# EAGLE design breadboard_rev05 (EAGLE 6.1)
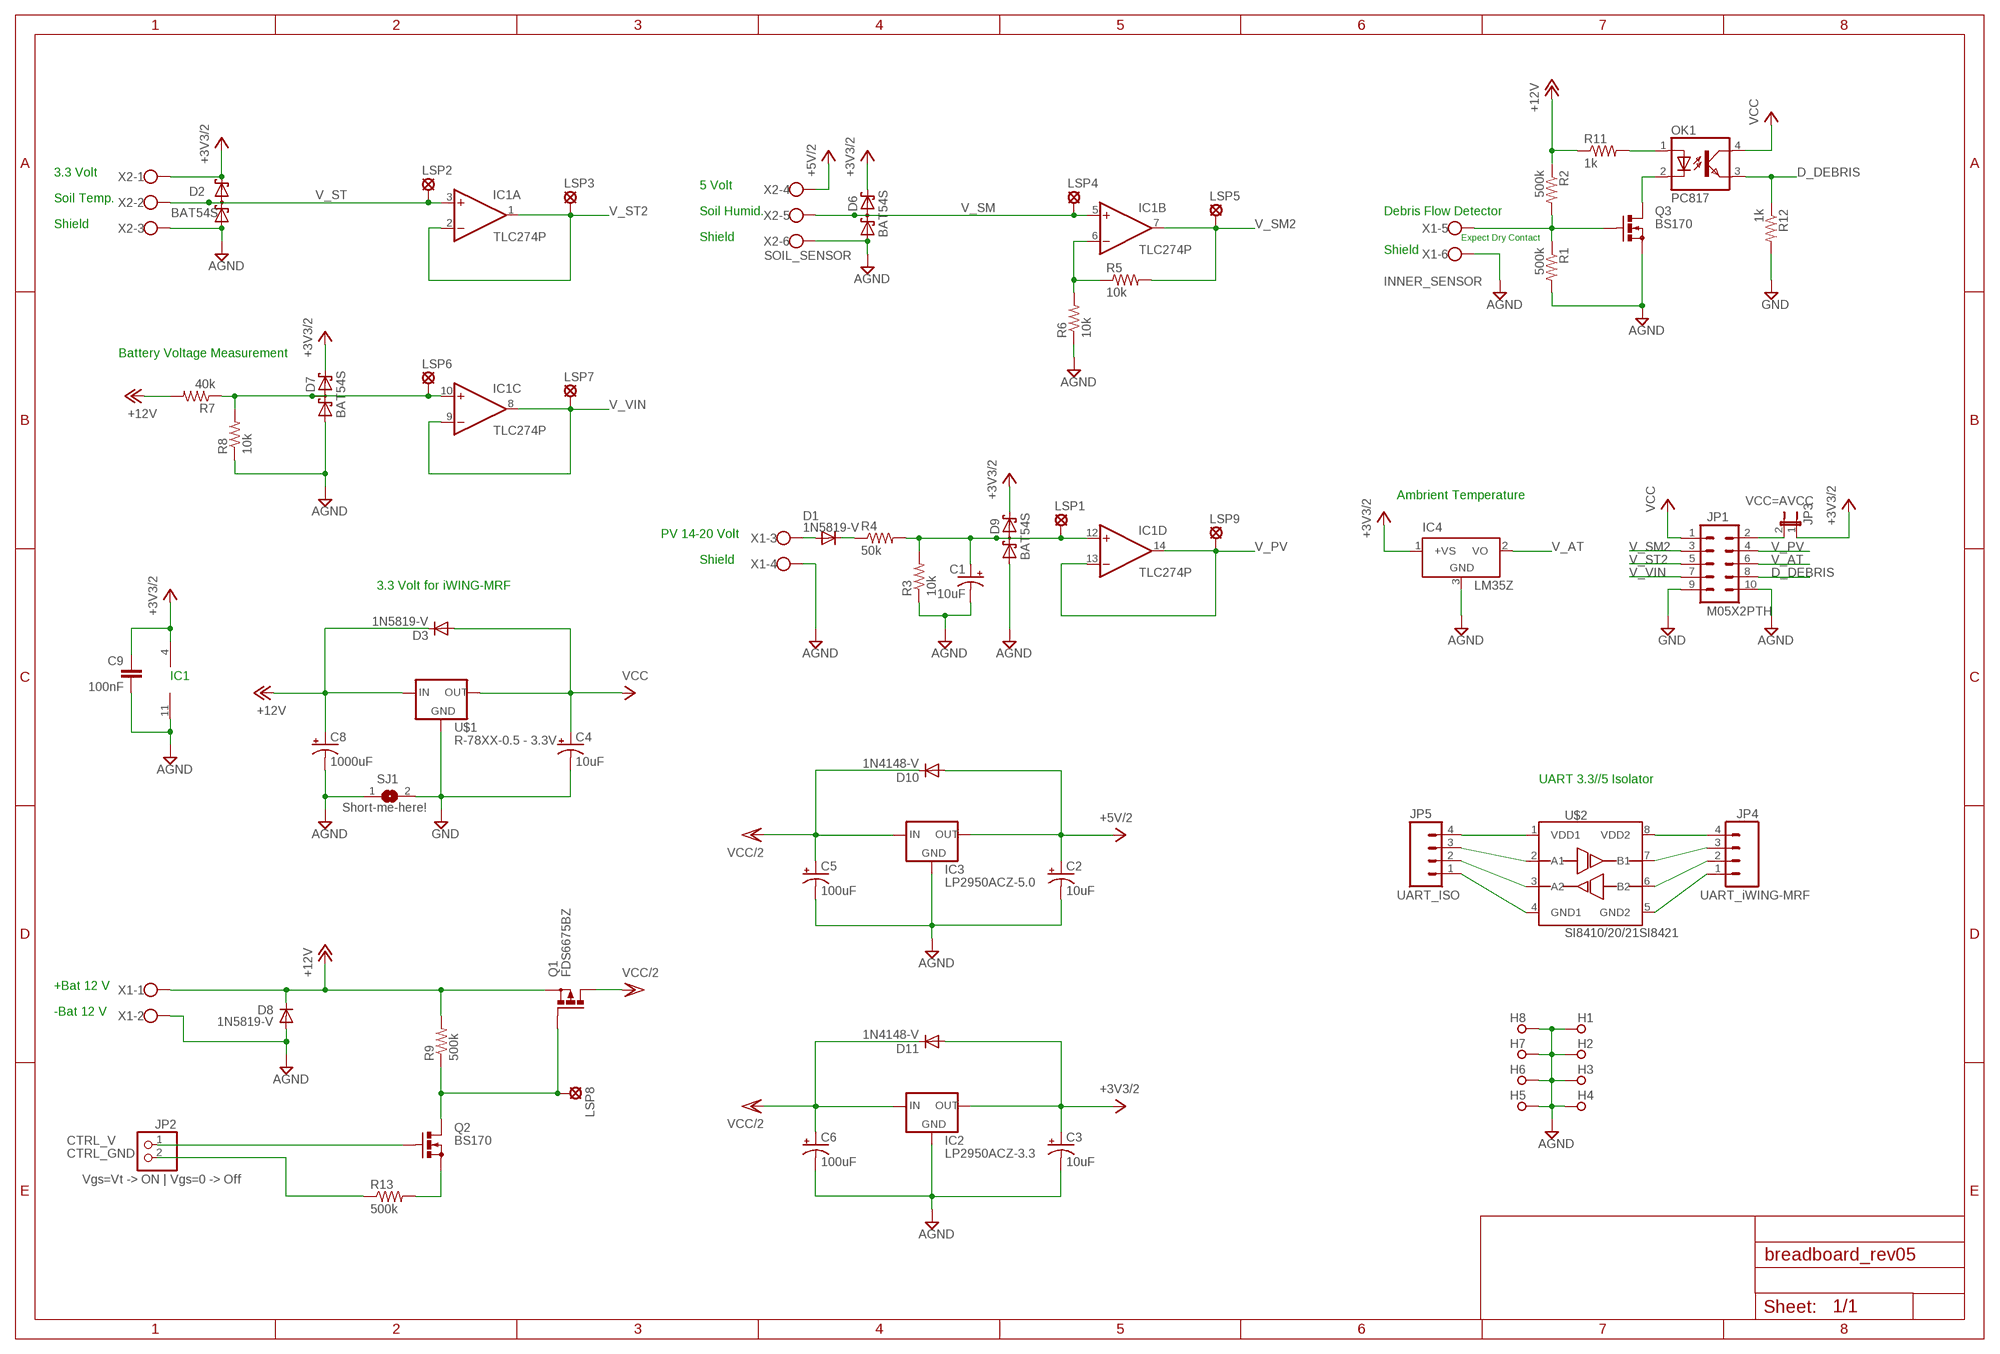
[diagram p0: schematic, sheet 1]

## Parts
C1  10uF  RCL_CPOL-USE2.5-7  [RCL_E2,5-7]
C2  10uF  RCL_CPOL-USE2.5-7  [RCL_E2,5-7]
C3  10uF  RCL_CPOL-USE2.5-7  [RCL_E2,5-7]
C4  10uF  RCL_CPOL-USE2.5-7  [RCL_E2,5-7]
C5  100uF  RCL_CPOL-USE2.5-7  [RCL_E2,5-7]
C6  100uF  RCL_CPOL-USE2.5-7  [RCL_E2,5-7]
C8  1000uF  RCL_CPOL-USE5-13  [RCL_E5-13]
C9  100nF  RCL_C-EU050-025X075  [RCL_C050-025X075]
D1  1N5819-V  [DO41-150V]
D2  BAT54S  [SOT23]
D3  1N5819-V  [DO41-150V]
D6  BAT54S  [SOT23]
D7  BAT54S  [SOT23]
D8  1N5819-V  [DO41-150V]
D9  BAT54S  [SOT23]
D10  1N4148-V  [DO35-100V]
D11  1N4148-V  [DO35-100V]
H1  SPECIAL_DRILL_0.1560  [PAD_0.1560]
H2  SPECIAL_DRILL_0.1560  [PAD_0.1560]
H3  SPECIAL_DRILL_0.1560  [PAD_0.1560]
H4  SPECIAL_DRILL_0.1560  [PAD_0.1560]
H5  SPECIAL_DRILL_0.1560  [PAD_0.1560]
H6  SPECIAL_DRILL_0.1560  [PAD_0.1560]
H7  SPECIAL_DRILL_0.1560  [PAD_0.1560]
H8  SPECIAL_DRILL_0.1560  [PAD_0.1560]
IC1  TLC274P  [DIL14]
IC2  LP2950ACZ-3.3  [TO92]
IC3  LP2950ACZ-5.0  [TO92]
IC4  LM35Z  [TO92]
JP1  M05X2PTH  [AVR_ICSP]
JP2  Vgs=Vt -> ON | Vgs=0 -> Off  PINHD-1X2  [1X02]
JP3  VCC=AVCC  JP1E  [JUMPER_JP1]
JP4  UART_iWING-MRF  M04POLAR  [MOLEX-1X4]
JP5  UART_ISO  M04POLAR  [MOLEX-1X4]
LSP1  LSP13  [LSP13]
LSP2  LSP13  [LSP13]
LSP3  LSP13  [LSP13]
LSP4  LSP13  [LSP13]
LSP5  LSP13  [LSP13]
LSP6  LSP13  [LSP13]
LSP7  LSP13  [LSP13]
LSP8  LSP13  [LSP13]
LSP9  LSP13  [LSP13]
OK1  PC817  [DIL04]
Q1  FDS6675BZ  P-MOSFET-SO8  [SO-08]
Q2  BS170  [SOT54E]
Q3  BS170  [SOT54E]
R1  500k  RCL_R-US_0204/7  [RCL_0204/7]
R2  500k  RCL_R-US_0204/7  [RCL_0204/7]
R3  10k  RCL_R-US_0204/7  [RCL_0204/7]
R4  50k  RCL_R-US_0204/7  [RCL_0204/7]
R5  10k  RCL_R-US_0204/7  [RCL_0204/7]
R6  10k  RCL_R-US_0204/7  [RCL_0204/7]
R7  40k  RCL_R-US_0204/7  [RCL_0204/7]
R8  10k  RCL_R-US_0204/7  [RCL_0204/7]
R9  500k  RCL_R-US_0204/7  [RCL_0204/7]
R11  1k  RCL_R-US_0204/7  [RCL_0204/7]
R12  1k  RCL_R-US_0204/7  [RCL_0204/7]
R13  500k  RCL_R-US_0204/7  [RCL_0204/7]
SJ1  Short-me-here!  SJ  [SJ]
U$1  R-78XX-0.5 - 3.3V  R-78XX-0.5  [SIP3]
U$2  SI8410/20/21SI8421  [SO-08]
X1  INNER_SENSOR  5EHDRC-6P  [5EHDRC-6P]
X2  SOIL_SENSOR  5EHDRC-6P  [5EHDRC-6P]

## Nets
+3V3/2: C3.+ C9.1 D2.2(C2) D6.2(C2) D7.2(C2) D9.2(C2) D11.A IC1.4(P:V+) IC2.1(OUT) IC4.1(+VS) JP3.1 X2.1
+5V/2: C2.+ D10.A IC3.1(OUT) X2.4
+12V: C8.+ D3.C D8.C Q1.1(S) Q1.2(S) Q1.3(S) R2.1 R7.2 R9.2 R11.1 U$1.1(IN) X1.1
AGND: C1.- C2.- C3.- C5.- C6.- C8.- C9.2 D2.1(A1) D6.1(A1) D7.1(A1) D8.A D9.1(A1) H1.1 H2.1 H3.1 H4.1 H5.1 H6.1 H7.1 H8.1 IC1.11(P:V-) IC2.2(GND) IC3.2(GND) IC4.3(GND) JP1.10 Q3.S R1.2 R3.1 R6.1 R8.1 SJ1.1 X1.2 X1.4 X1.6 X2.3 X2.6
CTRL_GND: JP2.2 R13.1
CTRL_V: JP2.1 Q2.G
D_DEBRIS: JP1.8 OK1.3(EMIT) R12.1
GND: C4.- JP1.9 R12.2 SJ1.2 U$1.2(GND)
N$2: D7.3(C1A2) IC1.10(C:+IN) LSP6.MP R7.1 R8.2
N$3: IC1.6(B:-IN) R5.1 R6.2
N$10: LSP8.MP Q1.4(G) Q2.D R9.1
N$13: JP1.2 JP3.2
N$14: OK1.1(A) R11.2
N$15: Q2.S R13.2
N$16: OK1.2(C) Q3.D
N$17: Q3.G R1.1 R2.2 X1.5
N$18: D1.A X1.3
N$19: JP4.4 U$2.8(VDD2)
N$20: D1.C R4.1
N$21: JP4.1 U$2.5(GND2)
N$22: JP5.4 U$2.1(VDD1)
N$23: JP5.3 U$2.2(A1)
N$24: C1.+ D9.3(C1A2) IC1.12(D:+IN) LSP1.MP R3.2 R4.2
N$25: JP5.2 U$2.3(A2)
N$26: JP5.1 U$2.4(GND1)
RX: JP4.3 U$2.7(B1)
TX: JP4.2 U$2.6(B2)
V_AT: IC4.2(VO) JP1.6
V_PV: IC1.13(D:-IN) IC1.14(D:OUT) JP1.4 LSP9.MP
V_SM: D6.3(C1A2) IC1.5(B:+IN) LSP4.MP X2.5
V_SM2: IC1.7(B:OUT) JP1.3 LSP5.MP R5.2
V_ST: D2.3(C1A2) IC1.3(A:+IN) LSP2.MP X2.2
V_ST2: IC1.1(A:OUT) IC1.2(A:-IN) JP1.5 LSP3.MP
V_VIN: IC1.8(C:OUT) IC1.9(C:-IN) JP1.7 LSP7.MP
VCC: C4.+ D3.A JP1.1 OK1.4(COL) U$1.3(OUT)
VCC/2: C5.+ C6.+ D10.C D11.C IC2.3(IN) IC3.3(IN) Q1.5(D) Q1.6(D) Q1.7(D) Q1.8(D)

## Notes on the sheet
- 3.3 Volt
- 5 Volt
- Soil Temp.
- Soil Humid. | Debris Flow Detector
- Shield
- Shield | Expect Dry Contact
- Shield
- Battery Voltage Measurement
- Ambrient Temperature
- PV 14-20 Volt
- Shield
- 3.3 Volt for iWING-MRF
- IC1
- UART 3.3//5 Isolator
- +Bat 12 V
- -Bat 12 V

## Library data of the parts
C1-C6 C8 = SDI12IB_v0.5:RCL_CPOL-US: POLARIZED CAPACITOR, American symbol
C9 = ipas:RCL_C-EU: CAPACITOR, European symbol
D1 D3 D8 = ipas:1N5819: DIODE 1N5817 THRU 1N5819 1.0 AMP. Schottky Barrier Rectifiers Features Low forward voltage drop High current capability High reliability High surge current capability
D2 D6 D7 D9 = diode:BAT54S: Schottky Diodes Pin connection corrected 2011-05-04 Source: Fairchild .. BAT54.pdf
D10 D11 = ipas:1N4148: DIODE high speed (Philips)
H1-H8 = ipas:SPECIAL_DRILL_: Special drills
IC1 = linear:TLC274: OP AMP
IC2 IC3 = v-reg:LP2950?*: Source: http://cache.national.com/ds/LP/LP2950.pdf
IC4 = ipas:LM35: Precision Centigrade Temperature Sensors Features Calibrated directly in ̊ Celsius (Centigrade) Linear + 10.0 mV/ ̊C scale factor 0.5 ̊C accuracy guaranteeable (at +25 ̊C) Rated for full −55 ̊ to +150 ̊C range Suitable for remote applications Low cost due to wafer-level trimming Operates from 4 to 30 volts Less than 60 μA current drain Low self-heating, 0.08 ̊C in still air Nonlinearity only ± 1⁄4 ̊C typical Low impedance output, 0.1 Ω for 1 mA load The LM35 series are precision integrated-circuit temperature sensors, whose output voltage is linearly proportional to the Celsius (Centigrade) temperature. The LM35 thus has an advantage over linear temperature sensors calibrated in ̊ Kelvin, as the user is not required to subtract a large constant voltage from its output to obtain convenient Centi- grade scaling. The LM35 does not require any external calibration or trimming to provide typical accuracies of ± 1⁄4 ̊C at room temperature and ± 3⁄4 ̊C over a full −55 to +150 ̊C temperature range. Low cost is assured by trimming and calibration at the wafer level. The LM35’s low output imped- ance, linear output, and precise inherent calibration make interfacing to readout or control circuitry especially easy. It can be used with single power supplies, or with plus and minus supplies. As it draws only 60 μA from its supply, it has very low self-heating, less than 0.1 ̊C in still air. The LM35 is rated to operate over a −55 ̊ to +150 ̊C temperature range, while the LM35C is rated for a −40 ̊ to +110 ̊C range (−10 ̊ with improved accuracy). The LM35 series is available pack- aged in hermetic TO-46 transistor packages, while the LM35C, LM35CA, and LM35D are also available in the plastic TO-92 transistor package. The LM35D is also avail- able in an 8-lead surface mount small outline package and a plastic TO-220 package. Source: http://cache.national.com/ds/LM/LM50.pdf
JP1 = SparkFun-Connectors:M05X2: Header 5x2 Standard 10-pin dual row 0.1" header. Commonly used with AVR-ISP. Use with Spark Fun Electronics SKU: PRT-00778
JP2 = pinhead:PINHD-1X2: PIN HEADER
JP3 = ipas:JP1E: JUMPER
JP4 JP5 = ipas:M04: Header 4 Standard 4-pin 0.1" header. Use with straight break away headers (SKU : PRT-00116), right angle break away headers (PRT-00553), swiss pins (PRT-00743), machine pins (PRT-00117), and female headers (PRT-00115). Molex polarized connector foot print use with SKU : PRT-08231 with associated crimp pins and housings. 1MM SMD Version SKU: PRT-10208
LSP1-LSP9 = solpad:LSP13: SOLDER PAD drill 1.3 mm, distributor Buerklin, 12H562
OK1 = ipas:PC817: SHARP OPTO COUPLER; MPN: PC817X4J000F; OC_FARNELL: 9707727; OC_NEWARK: 97K7059
Q1 = transistor-power:P-MOSFET-SO8: P-Channel MOSFET Example: FDS4435A; P-Channel Logic Level PowerTrench® MOSFET FDS4465; P-Channel 1.8V Specified PowerTrench® MOSFET Source: www.fairchildsemi.com
Q2 Q3 = transistor-small-signal:BS170: N-CHANNEL MOS FET
R1-R9 R11-R13 = SDI12IB_v0.5:RCL_R-US_: RESISTOR, American symbol
SJ1 = jumper:SJ: SMD solder JUMPER
U$1 = ipas:R-78XX-0.5: The R-78xx-Series high efficiency switching regulators are ideally suited to replace 78xx linear regulators and are pin compatible. The efficiency of up to 97% means that very little energy is wasted as heat so there is no need for any heat sinks with their additional space and mounting costs. Low ripple and noise figures and short circuit , overload and over- temperature protection round off the specifications of this versatile converter series.This R-78xx-0.5 is fully certified to EN 60601-1-2 (Medical Equipment), EN 55022 (Emissions), and EN55024 (Immunity) EMC Standards and for EN-60950-1 Safety.
U$2 = ipas:SI8410/20/21: SI8410 / SI8420 / SI8421 ISOPROLOW - POWER SINGLE AND DUAL-CHANNEL DIGITAL ISOLATORS Features High-speed operation Narrow Body SOIC Wide Operating Supply Voltage: isolation 2.70–5.5 V 5 V Operation: 2.70 V Operation: The Silicon Laboratories’ family of ultra low power digital isolators are CMOS devices that employ an RF coupler to transmit digital information across an isolation barrier. Very high speed operation at low power levels is achieved. These devices are available in an 8-pin narrow-body SOIC package. Two speed grade options (1 and 150 Mbps) are available and achieve worst-case propagation delays of less than 10 ns.
X1 X2 = ipas:5EHDRC-6P: Dinkle Headers(Sockets) for pluggable terminal blocks / ECH & EHD series TERMINAL BLOCK, 300V/15A

## Net classes
1 power: width 0.406 mm, clearance 0.203 mm

## Board
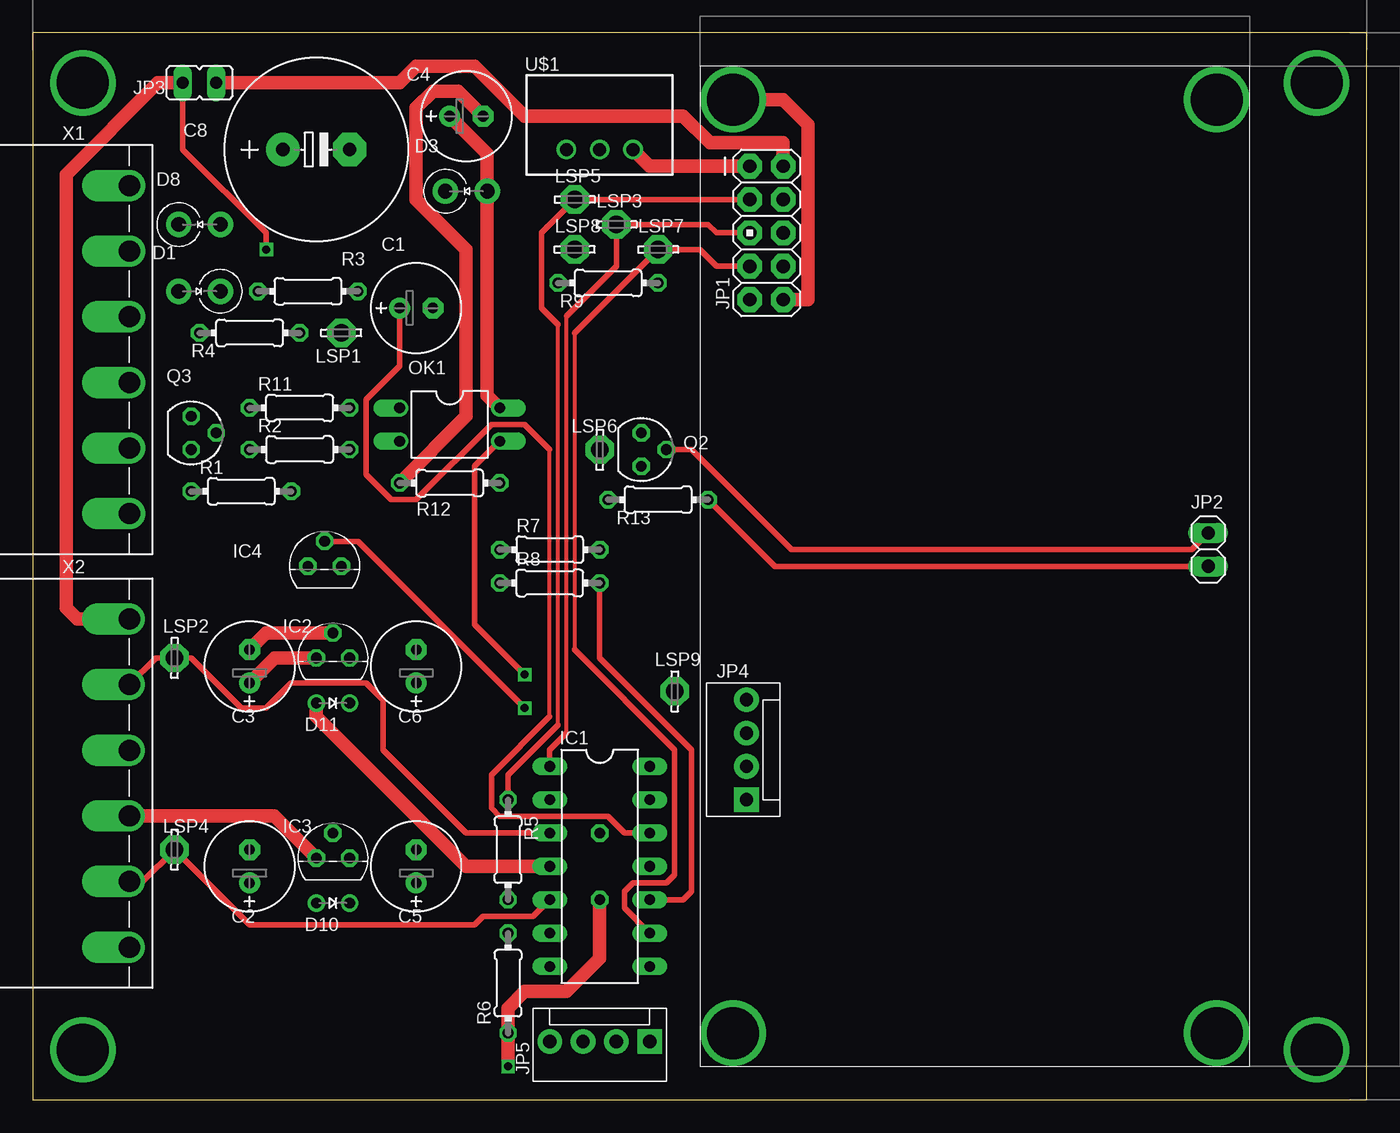
[diagram p1: board, top side]
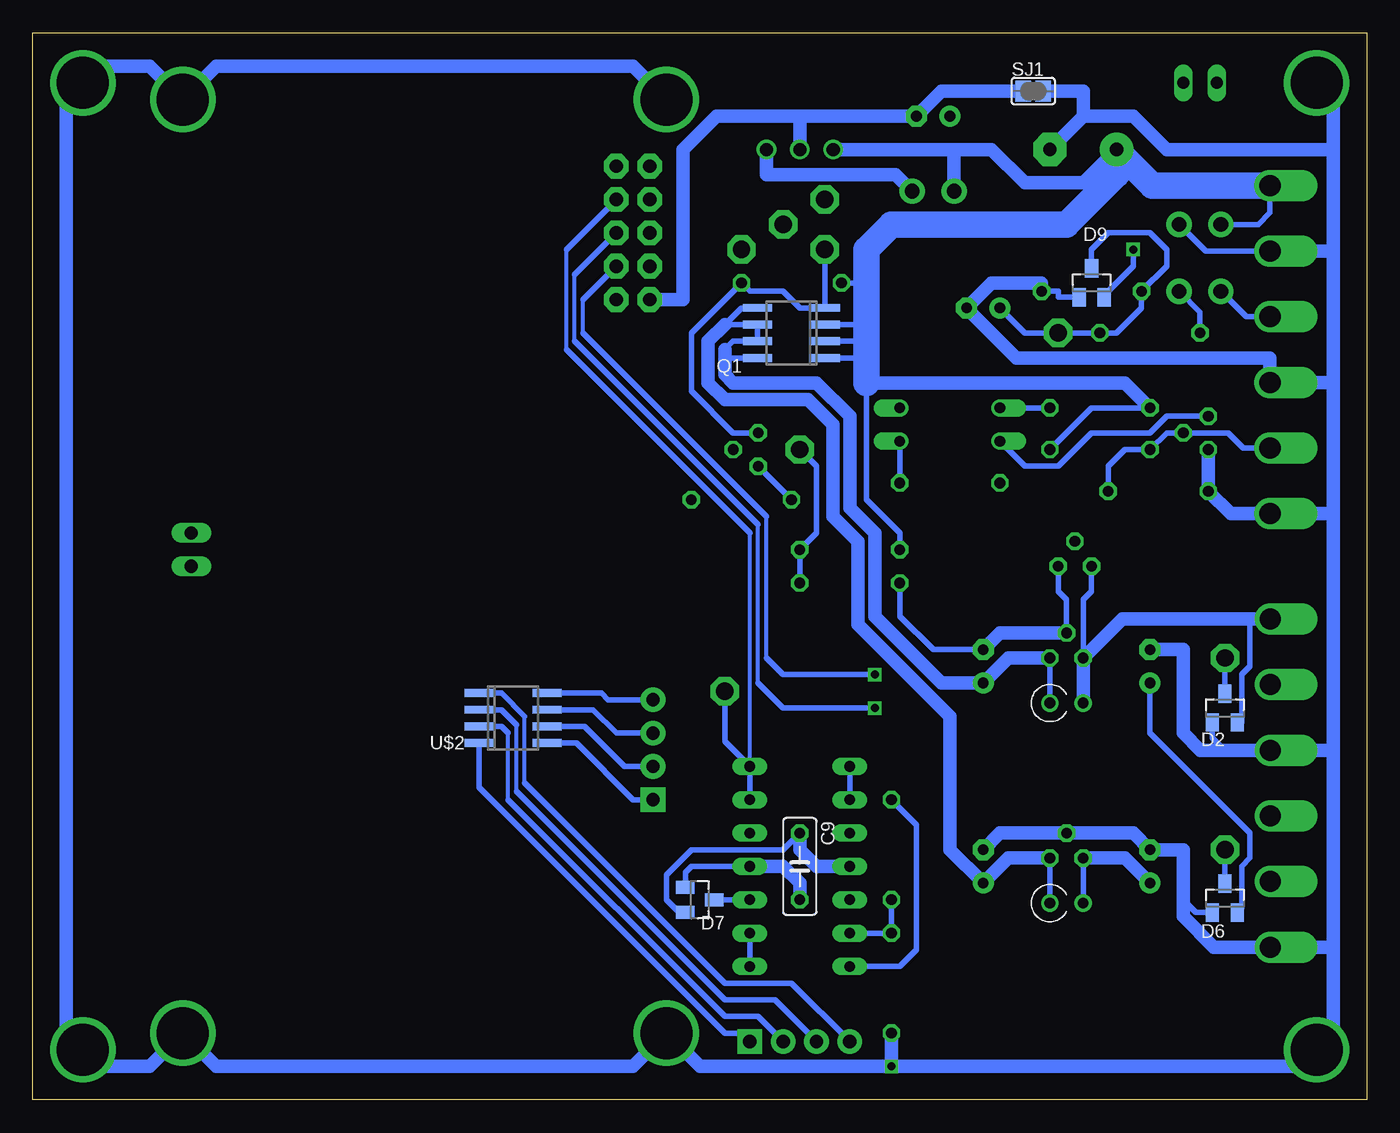
[diagram p2: board, bottom side, seen from below]

Size 101.6 x 81.28 mm. Coordinates in mm from the lower left corner, seen from the top.
Outline: 0,0 101.6,0 101.6,81.28 0,81.27 0,0
Copper layers (1*16): Top 0.035mm / dielectric 1.5mm / Bottom 0.035mm
Design rules: minimum track width 10mil, minimum drill 24mil, track to track 10mil, track to pad 10mil, pad to pad 10mil, via to via 10mil, smd to smd 10mil, copper to edge 40mil, drill to drill 10mil, minimum pad ring 10mil, minimum via ring 8mil, stop-mask expansion 4mil, vias tented up to drill 0mil, thermal gap 10mil

### Footprints (pad centres in the part's own frame; a part is rotated, then mirrored left to right if it is on the bottom)
RCL_E2,5-7 = drill 0.813 pad 1.6: + -1.27,0 | drill 0.813 pad 1.6 octagon: - 1.27,0
RCL_E5-13 = drill 1.016 pad 2.54: + -2.54,0 | drill 1.016 pad 2.54 octagon: - 2.54,0
RCL_C050-025X075 = drill 0.813 octagon: 1 -2.54,0; 2 2.54,0
DO41-150V = drill 1.118 pad 1.93: A 1.587,0; C -1.587,0
SOT23 = smd 1 x 1.4: 1 -0.95,-1.1; 2 0.95,-1.1; 3 0,1.1
DO35-100V = drill 0.813: A 1.27,0; C -1.27,0
PAD_0.1560 = drill 3.962 pad 3.962: 1 0,0
DIL14 = drill 0.813 long: 1 -7.62,-3.81; 2 -5.08,-3.81; 3 -2.54,-3.81; 4 0,-3.81; 5 2.54,-3.81; 6 5.08,-3.81; 7 7.62,-3.81; 8 7.62,3.81; 9 5.08,3.81; 10 2.54,3.81; 11 0,3.81; 12 -2.54,3.81; 13 -5.08,3.81; 14 -7.62,3.81
TO92 = drill 0.813 octagon: 1 -1.27,0; 2 0,1.905; 3 1.27,0
AVR_ICSP = drill 1.016 pad 1.88 octagon: 1 -1.27,5.08; 2 1.27,5.08; 3 -1.27,2.54; 4 1.27,2.54; 5 -1.27,0; 6 1.27,0; 7 -1.27,-2.54; 8 1.27,-2.54; 9 -1.27,-5.08; 10 1.27,-5.08
1X02 = drill 1.016 long: 1 -1.27,0; 2 1.27,0
JUMPER_JP1 = drill 0.914 long: 1 0,-1.27; 2 0,1.27
MOLEX-1X4 = drill 1.016 pad 1.88 square: 1 0,0 | drill 1.016 pad 1.88: 2 2.54,0; 3 5.08,0; 4 7.62,0
LSP13 = drill 1.321 pad 2.159 octagon: MP 0,0
DIL04 = drill 0.813 offset: 1 -1.27,-3.81; 2 1.27,-3.81; 3 1.27,3.81; 4 -1.27,3.81
SO-08 = smd 0.6 x 2.2: 1 -1.905,-2.6; 2 -0.635,-2.6; 3 0.635,-2.6; 4 1.905,-2.6; 5 1.905,2.6; 6 0.635,2.6; 7 -0.635,2.6; 8 -1.905,2.6
SOT54E = drill 0.813 octagon: D -1.27,0; G 0,1.905; S 1.27,0
RCL_0204/7 = drill 0.813 octagon: 1 -3.81,0; 2 3.81,0
SJ = smd 1.168 x 1.6: 1 -0.762,0; 2 0.762,0
SIP3 = drill 1: 1 -2.54,-2.54; 2 0,-2.54; 3 2.54,-2.54
5EHDRC-6P = drill 1.6 offset: 1 -12.5,2.28; 2 -7.5,2.28; 3 -2.5,2.28; 4 2.5,2.28; 5 7.5,2.28; 6 12.5,2.28

### Placement (x,y rotation side)
C1  29.21,60.33 0 top
C2  16.51,17.78 90 top
C3  16.51,33.02 90 top
C4  33.02,74.93 0 top
C5  29.21,17.78 90 top
C6  29.21,33.02 90 top
C8  21.59,72.39 0 top
C9  43.18,17.78 270 bottom
D1  12.7,61.6 180 top
D2  10.79,29.84 0 bottom
D3  33.02,69.21 0 top
D6  10.79,15.37 0 bottom
D7  50.8,15.24 270 bottom
D8  12.7,66.67 0 top
D9  20.95,62.23 0 bottom
D10  22.86,14.99 180 top
D11  22.86,30.23 180 top
H1  3.81,77.47 0 top
H2  97.79,77.47 0 top
H3  97.79,3.81 0 top
H4  3.81,3.81 0 top
H5  53.34,76.2 0 top
H6  90.17,76.2 0 top
H7  90.17,5.08 0 top
H8  53.34,5.08 0 top
IC1  43.18,17.78 270 top
IC2  22.86,33.66 0 top
IC3  22.86,18.41 0 top
IC4  22.22,40.64 0 top
JP1  55.88,66.04 0 top
JP2  89.53,41.91 270 top
JP3  12.7,77.47 270 top
JP4  54.36,22.86 90 top
JP5  46.99,4.45 180 top
LSP1  23.5,58.42 180 top
LSP2  10.79,33.66 270 top
LSP3  44.45,66.67 0 top
LSP4  10.79,19.05 270 top
LSP5  41.28,68.58 0 top
LSP6  43.18,49.53 90 top
LSP7  47.62,64.77 0 top
LSP8  41.28,64.77 180 top
LSP9  48.9,31.11 90 top
OK1  31.75,51.44 270 top
Q1  43.82,58.42 90 bottom
Q2  46.36,49.53 270 top
Q3  12.06,50.8 270 top
R1  15.88,46.36 180 top
R2  20.32,49.53 180 top
R3  20.95,61.6 180 top
R4  16.51,58.42 0 top
R5  36.2,19.05 90 top
R6  36.2,8.89 90 top
R7  39.37,41.91 180 top
R8  39.37,39.37 0 top
R9  43.82,62.23 180 top
R11  20.32,52.71 0 top
R12  31.75,46.99 180 top
R13  47.62,45.72 180 top
SJ1  25.4,76.83 180 bottom
U$1  43.18,74.93 0 top
U$2  65.02,29.08 270 bottom
X1  5.08,57.15 270 top
X2  5.08,24.13 270 top

### Tracks (layer width: path | path; a pad name or v marks a point on that pad's centre or on a via)
+3V3/2  (via drill 0.61)
  Top 0.406: v17.78,64.77 17.78,66.04 11.43,72.39 JP3.1
  Top 1.016: IC2.1 18.41,33.66 C3.+ | JP3.1 9.53,77.47 2.54,70.48 2.54,37.47 3.38,36.63 X2.1 | IC1.4 33.02,17.78 21.59,29.21 D11.A
  Bottom 0.406: C3.+ 16.51,27.94 8.89,20.32 8.89,18.41 9.53,17.78 9.53,14.61 9.84,14.29 D6.2 | IC2.1 21.59,38.1 20.95,38.74 IC4.1 | D2.2 9.53,28.75 9.53,32.38 8.89,33.02 8.89,36.63 | D9.2 20,61.28 17.78,63.5 v17.78,64.77 | D7.2 52.39,14.29 53.34,15.24 53.34,17.14 51.44,19.05 44.45,19.05 C9.1
  Bottom 1.016: D11.A IC2.1 18.61,36.63 8.89,36.63 X2.1 | C9.1 43.18,19.05 41.91,17.78 IC1.4
+5V/2
  Top 1.016: X2.4 18.38,21.63 IC3.1
  Bottom 0.406: D10.A IC3.1
  Bottom 1.016: C2.+ 18.41,18.41 IC3.1
+12V
  Bottom 0.406: R2.1 20.95,52.71 R11.1 | D8.C 8.26,66.67 7.36,67.57 X1.1 | Q1.3 38.1,59.05 | Q1.2 38.1,57.79 | Q1.1 38.1,56.52 | R7.2 35.56,43.18 38.1,45.72 38.1,54.61 | R9.2 38.1,62.23
  Bottom 1.016: C8.+ 21.59,69.85 26.04,69.85 28.57,72.39 31.43,72.39 | 31.43,72.39 U$1.1 | D3.C 31.43,72.39 | R11.1 18.41,54.61 38.1,54.61
  Bottom 2.032: X1.1 16.31,69.65 C8.+ 19.05,70.48 22.86,66.67 36.2,66.67 38.1,64.77 38.1,62.23 38.1,59.05 38.1,57.79 38.1,56.52 38.1,54.61
AGND  (via drill 0.61)
  Top 1.016: C3.- 17.78,35.56 IC2.2 | v36.2,2.54 36.2,6.98 37.47,8.26 40.64,8.26 43.18,10.79 C9.2 | JP1.10 59.05,60.96 59.05,74.3 57.15,76.2 H5.1
  Bottom 0.406: R3.1 23.5,61.6 23.5,61.13 D9.1 | D8.A 12.26,64.65 X1.2 | 13.67,18.08 13.97,17.78 | C6.- 33.02,34.29 35.56,36.83 R8.1 | IC4.3 23.5,38.74 22.86,38.1 IC2.2 | D2.1 11.74,27.58 10.79,26.63 | D6.1 13,14.27 13.97,15.24 | D7.1 51.9,17.32 51.44,17.78 IC1.11
  Bottom 1.016: R3.1 24.77,62.23 28.57,62.23 C1.- 26.67,56.52 7.36,56.52 X1.4 2.54,54.65 | X1.2 2.54,64.65 | 2.54,64.65 2.54,54.65 | 2.54,44.65 X1.6 10.36,44.65 R1.2 Q3.S | 2.54,44.65 2.54,54.65 | 2.54,11.63 X2.6 11.63,11.63 13.97,13.97 13.97,15.24 13.97,17.78 13.97,19.05 C2.- 17.78,20.32 IC3.2 27.94,20.32 C5.- | 2.54,11.63 2.54,26.63 | 2.54,26.63 X2.3 10.79,26.63 12.66,26.63 13.97,27.94 13.97,34.29 C3.- | 2.54,44.65 2.54,26.63 | IC2.2 27.94,35.56 C6.- | 21.59,74.93 21.59,76.83 SJ1.1 | 21.59,74.93 C8.- | 2.54,64.65 2.54,72.39 | 2.54,72.39 15.24,72.39 17.78,74.93 21.59,74.93 | C9.2 43.18,16.51 44.45,17.78 IC1.11 | 2.54,11.63 2.54,5.08 H4.1 5.08,2.54 v36.2,2.54 | v36.2,2.54 50.8,2.54 H8.1 55.88,2.54 87.63,2.54 H7.1 92.71,2.54 96.52,2.54 H3.1 99.06,5.08 99.06,76.2 H2.1 96.52,78.74 92.71,78.74 H6.1 87.63,78.74 55.88,78.74 H5.1 | H1.1 2.54,76.2 2.54,72.39 | R6.1 v36.2,2.54
CTRL_GND
  Top 0.406: R13.1 56.52,40.64 JP2.2
CTRL_V
  Top 0.406: Q2.G 50.17,49.53 57.79,41.91 88.27,41.91 JP2.1
D_DEBRIS  (via drill 0.61)
  Top 0.406: OK1.3 33.66,48.26 33.66,36.2 v37.47,32.38
  Bottom 0.305: 45.72,33.66 45.72,44.45 | 59.69,58.42 59.69,60.96
  Bottom 0.406: OK1.3 R12.1 | v37.47,32.38 44.45,32.38 45.72,33.66 | 45.72,44.45 59.69,58.42 | 59.69,60.96 JP1.8
GND
  Top 1.016: C4.- 32.38,76.83 30.48,76.83 29.21,75.56 29.21,68.58 33.02,64.77 33.02,52.07 R12.2
  Bottom 1.016: 43.18,74.93 C4.- 32.38,76.83 SJ1.2 | U$1.2 43.18,74.93 | JP1.9 52.07,60.96 52.07,72.39 49.53,74.93 43.18,74.93
N$2
  Top 0.406: IC1.10 49.53,15.24 50.17,15.88 50.17,26.67 43.18,33.66 R8.2
  Bottom 0.406: R8.2 R7.1 41.91,43.18 41.91,48.26 LSP6.MP | D7.3 IC1.10
N$3
  Bottom 0.406: R5.1 R6.2 IC1.6
N$10
  Bottom 0.406: Q2.D 48.26,50.8 51.44,53.98 51.44,58.42 R9.1 46.99,61.6 44.45,61.6 43.18,60.33 Q1.4 41.28,60.33 LSP8.MP
N$13
  Top 1.016: JP3.2 27.94,77.47 29.21,78.74 33.66,78.74 37.47,74.93 49.53,74.93 51.56,72.9 57.15,72.9 JP1.2
N$14
  Bottom 0.406: R11.2 OK1.1
N$15
  Bottom 0.406: R13.2 Q2.S
N$16
  Bottom 0.406: OK1.2 26.04,48.26 23.5,48.26 20.95,50.8 16.51,50.8 15.24,52.07 Q3.D
N$17
  Bottom 0.406: X1.5 9.4,49.65 10.55,50.8 Q3.G 15.24,50.8 R2.2 18.41,49.53 19.68,48.26 R1.1
N$18
  Bottom 0.406: X1.3 9.17,59.65 D1.A
N$19
  Bottom 0.406: U$2.8 58.29,30.99 57.79,30.48 JP4.4
N$20
  Bottom 0.406: D1.C 12.7,60.01 R4.1
N$21
  Bottom 0.406: U$2.5 60.2,27.18 55.88,22.86 JP4.1
N$22
  Bottom 0.305: 64.14,24.13 64.14,29.21
  Bottom 0.406: JP5.4 43.82,8.89 48.9,8.89 64.14,24.13 | U$2.1 65.91,30.99 64.14,29.21
N$23
  Bottom 0.305: 64.77,23.5 64.77,28.57
  Bottom 0.406: JP5.3 45.09,7.62 48.9,7.62 64.77,23.5 | U$2.2 65.91,29.72 64.77,28.57
N$24
  Top 0.305: 39.37,29.21 39.37,49.53
  Top 0.406: C1.+ 27.94,55.88 25.4,53.34 25.4,47.62 27.3,45.72 29.21,45.72 34.93,51.44 37.47,51.44 39.37,49.53 | IC1.12 45.09,20.32 43.82,21.59 35.56,21.59 34.93,22.22 34.93,24.77 39.37,29.21
  Bottom 0.406: C1.+ 26.04,58.42 LSP1.MP R4.2 19.05,58.42 17.14,60.33 R3.2 15.24,63.5 15.24,64.77 16.51,66.04 19.68,66.04 20.95,64.77 D9.3
N$25
  Bottom 0.305: 65.41,22.86 65.41,27.94
  Bottom 0.406: JP5.2 46.36,6.35 48.9,6.35 65.41,22.86 | U$2.3 65.91,28.45 65.41,27.94
N$26
  Bottom 0.406: JP5.1 47.62,5.08 48.9,5.08 67.62,23.81 U$2.4
RX
  Bottom 0.406: U$2.7 58.93,29.72 57.15,27.94 JP4.3
TX
  Bottom 0.406: U$2.6 59.56,28.45 56.52,25.4 JP4.2
V_AT  (via drill 0.61)
  Top 0.406: IC4.2 24.77,42.55 v37.47,29.84
  Bottom 0.305: 60.33,57.79 60.33,62.87 | 46.36,31.75 46.36,43.82
  Bottom 0.406: 46.36,43.82 60.33,57.79 | 60.33,62.87 JP1.6 | v37.47,29.84 44.45,29.84 46.36,31.75
V_PV
  Bottom 0.305: IC1.14 46.99,43.18 | 60.96,57.15 60.96,64.77
  Bottom 0.406: IC1.13 IC1.14 48.9,27.3 LSP9.MP | 46.99,43.18 60.96,57.15 | 60.96,64.77 JP1.4
V_SM
  Top 0.406: IC1.5 38.1,13.97 34.29,13.97 33.66,13.33 16.51,13.33 LSP4.MP 8.38,16.63 X2.5
  Bottom 0.406: D6.3 LSP4.MP
V_SM2
  Top 0.305: 40.01,28.57 40.01,59.05
  Top 0.406: 40.01,59.05 38.74,60.33 38.74,66.04 LSP5.MP JP1.3 | 40.01,28.57 36.2,24.77 R5.2
  Bottom 0.406: R5.2 34.29,20.95 34.29,11.43 35.56,10.16 IC1.7
V_ST
  Top 0.406: IC1.3 33.02,20.32 26.67,26.67 26.67,30.48 25.4,31.75 19.68,31.75 17.78,29.84 15.88,29.84 12.06,33.66 LSP2.MP 9.38,33.66 X2.2
  Bottom 0.406: D2.3 LSP2.MP
V_ST2
  Top 0.305: 40.64,27.94 40.64,59.69
  Top 0.406: IC1.1 39.37,26.67 40.64,27.94 | 40.64,59.69 44.45,63.5 LSP3.MP 51.44,66.67 52.07,66.04 JP1.5
  Bottom 0.406: IC1.2 IC1.1
V_VIN
  Top 0.305: 41.28,58.42 41.28,34.29
  Top 0.406: JP1.7 52.07,63.5 50.8,64.77 LSP7.MP 41.28,58.42 | 41.28,34.29 48.9,26.67 48.9,17.14 48.26,16.51 45.72,16.51 45.09,15.88 45.09,14.61 IC1.9
  Bottom 0.406: IC1.8 IC1.9
VCC
  Top 1.016: C4.+ 34.61,72.07 D3.A 34.61,53.66 OK1.4 | JP1.1 46.99,71.12 U$1.3
  Bottom 1.016: D3.A 35.88,70.48 45.72,70.48 U$1.3
VCC/2
  Bottom 0.406: D11.C IC2.3 | D10.C IC3.3 | 48.9,57.15 48.26,57.79 Q1.7 Q1.6 48.9,59.05 47.62,60.33 Q1.5 | Q1.8 48.9,56.52
  Bottom 1.016: IC2.3 27.3,33.66 C6.+ 32.38,31.75 37.47,36.83 37.47,43.18 39.37,45.09 39.37,52.07 41.91,54.61 48.26,54.61 48.9,55.25 48.9,56.52 48.9,57.15 | IC3.3 27.3,18.41 C5.+ 31.75,19.05 31.75,29.21 38.74,36.2 38.74,42.55 40.64,44.45 40.64,51.44 42.55,53.34 48.9,53.34 50.17,54.61 50.17,57.79 48.9,59.05